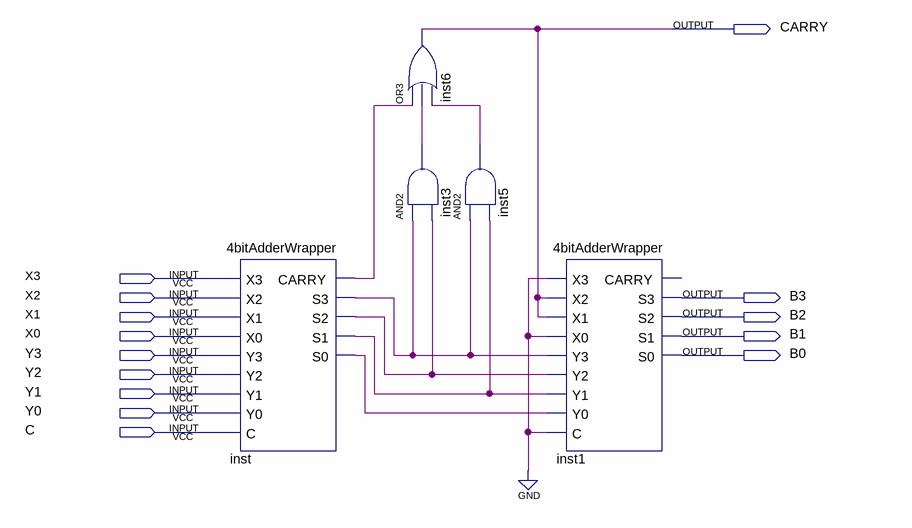
[diagram p0: schematic sheet]
// Quartus schematic BCDAdder.bdf as structural Verilog: 5 symbols, 14 pins
module BCDAdder (
  input  X3,
  input  X2,
  input  X1,
  input  X0,
  input  Y3,
  input  Y2,
  input  Y1,
  input  Y0,
  input  C,
  output CARRY,
  output B3,
  output B2,
  output B1,
  output B0
);

  wire inst3_out, inst5_out, inst_carry, inst_s0, inst_s1, inst_s2, inst_s3;

  \4bitAdderWrapper  inst (
    .X3(X3), .X2(X2), .X1(X1), .X0(X0), .Y3(Y3), .Y2(Y2), .Y1(Y1), .Y0(Y0), .C(C), .CARRY(inst_carry),
    .S3(inst_s3), .S2(inst_s2), .S1(inst_s1), .S0(inst_s0));
  or inst6 (CARRY, inst_carry, inst3_out, inst5_out);
  and inst3 (inst3_out, inst_s3, inst_s2);
  and inst5 (inst5_out, inst_s3, inst_s1);
  \4bitAdderWrapper  inst1 (
    .X3(1'b0), .X2(CARRY), .X1(CARRY), .X0(1'b0), .Y3(inst_s3), .Y2(inst_s2), .Y1(inst_s1), .Y0(inst_s0),
    .C(1'b0), .S3(B3), .S2(B2), .S1(B1), .S0(B0));  // open: CARRY
endmodule
